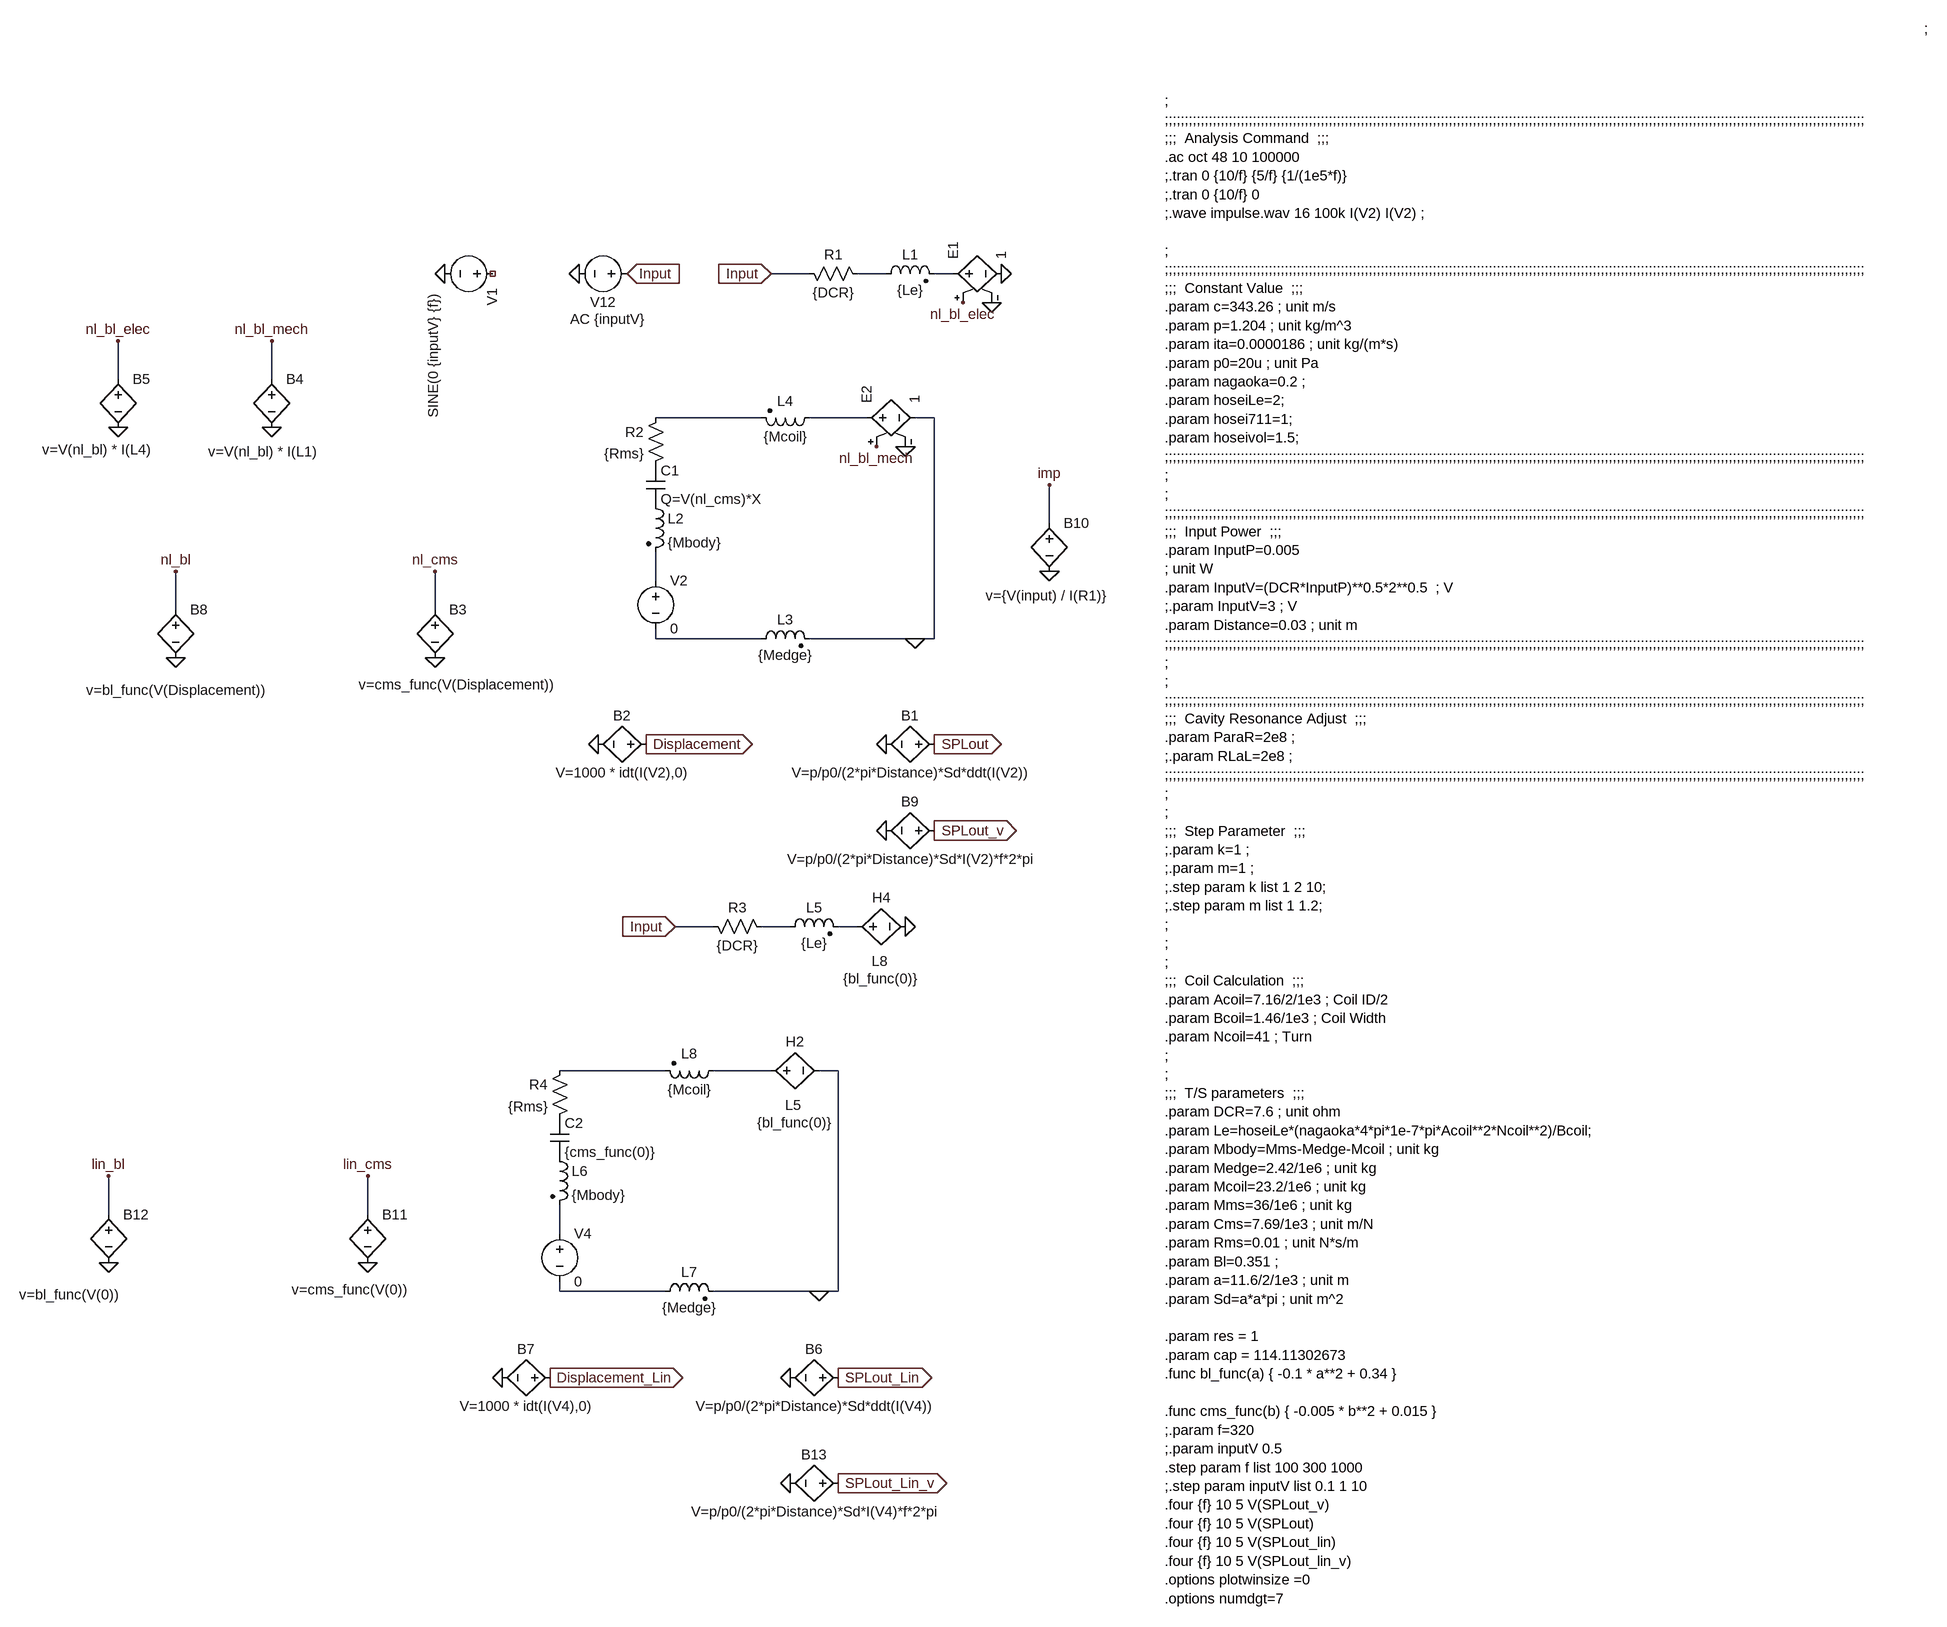
[diagram p0: schematic demo_11_2.asc]
demo_11_2.asc, the LTspice schematic file:
Version 4
SHEET 1 6896 9720
WIRE -2672 -416 -2736 -416
WIRE -2544 -416 -2592 -416
WIRE -2432 -416 -2464 -416
WIRE -3824 -240 -3824 -304
WIRE -3568 -240 -3568 -304
WIRE -2752 -176 -2928 -176
WIRE -2576 -176 -2672 -176
WIRE -2464 -176 -2496 -176
WIRE -2272 0 -2272 -64
WIRE -2928 96 -2928 48
WIRE -3728 144 -3728 80
WIRE -3296 144 -3296 80
WIRE -2928 192 -2928 176
WIRE -2752 192 -2928 192
WIRE -2496 192 -2672 192
WIRE -2464 192 -2464 -176
WIRE -2464 192 -2496 192
WIRE -2832 672 -2896 672
WIRE -2704 672 -2752 672
WIRE -2592 672 -2624 672
WIRE -2912 912 -3088 912
WIRE -2736 912 -2832 912
WIRE -2624 912 -2656 912
WIRE -3840 1152 -3840 1088
WIRE -3408 1152 -3408 1088
WIRE -3088 1184 -3088 1136
WIRE -3088 1280 -3088 1264
WIRE -2912 1280 -3088 1280
WIRE -2656 1280 -2832 1280
WIRE -2624 1280 -2624 912
WIRE -2624 1280 -2656 1280
FLAG -3056 -416 0
FLAG -2976 -416 Input
IOPIN -2976 -416 In
FLAG -2352 -416 0
FLAG -2736 -416 Input
IOPIN -2736 -416 In
FLAG -2496 192 0
FLAG -2464 368 SPLout
IOPIN -2464 368 Out
FLAG -2544 368 0
FLAG -2944 368 Displacement
IOPIN -2944 368 Out
FLAG -3024 368 0
FLAG -3280 -416 0
FLAG -3296 224 0
FLAG -3296 80 nl_cms
FLAG -3568 -160 0
FLAG -3568 -304 nl_bl_mech
FLAG -3824 -160 0
FLAG -3824 -304 nl_bl_elec
FLAG -2416 -368 nl_bl_elec
FLAG -2560 -128 nl_bl_mech
FLAG -2512 -128 0
FLAG -2368 -368 0
FLAG -2512 672 0
FLAG -2896 672 Input
IOPIN -2896 672 In
FLAG -2656 1280 0
FLAG -2624 1424 SPLout_Lin
IOPIN -2624 1424 Out
FLAG -2704 1424 0
FLAG -3104 1424 Displacement_Lin
IOPIN -3104 1424 Out
FLAG -3184 1424 0
FLAG -3728 224 0
FLAG -3728 80 nl_bl
FLAG -2464 512 SPLout_v
IOPIN -2464 512 Out
FLAG -2544 512 0
FLAG -2272 80 0
FLAG -2272 -64 imp
FLAG -3408 1232 0
FLAG -3408 1088 lin_cms
FLAG -3840 1232 0
FLAG -3840 1088 lin_bl
FLAG -2624 1600 SPLout_Lin_v
IOPIN -2624 1600 Out
FLAG -2704 1600 0
SYMBOL voltage -2960 -416 R90
WINDOW 0 32 56 VTop 2
WINDOW 3 -32 56 VBottom 2
WINDOW 123 60 48 VTop 2
SYMATTR InstName V12
SYMATTR Value ""
SYMATTR Value2 AC {inputV}
SYMBOL res -2688 -432 M90
WINDOW 0 0 56 VBottom 2
WINDOW 3 32 56 VTop 2
SYMATTR InstName R1
SYMATTR Value {DCR}
SYMBOL ind2 -2560 -400 R270
WINDOW 0 32 56 VTop 2
WINDOW 3 4 56 VBottom 2
SYMATTR InstName L1
SYMATTR Value {Le}
SYMATTR Type ind
SYMBOL res -2912 -192 M0
SYMATTR InstName R2
SYMATTR Value {Rms}
SYMBOL cap -2944 -96 R0
SYMATTR InstName C1
SYMATTR Value Q=V(nl_cms)*X
SYMBOL h -2752 912 R270
WINDOW 0 32 56 VTop 2
WINDOW 3 -71 55 VBottom 2
WINDOW 38 -42 53 VBottom 2
SYMATTR InstName H2
SYMATTR Value {bl_func(0)}
SYMATTR SpiceModel L5
SYMBOL ind2 -2944 -48 R0
SYMATTR InstName L2
SYMATTR Value {Mbody}
SYMBOL voltage -2928 80 R0
SYMATTR InstName V2
SYMATTR Value 0
SYMBOL ind2 -2768 208 R270
WINDOW 0 32 56 VTop 2
WINDOW 3 4 56 VBottom 2
SYMATTR InstName L3
SYMATTR Value {Medge}
SYMBOL ind2 -2656 -192 R90
WINDOW 0 4 56 VBottom 2
WINDOW 3 32 56 VTop 2
SYMATTR InstName L4
SYMATTR Value {Mcoil}
SYMBOL bv -2448 368 R90
WINDOW 0 -32 56 VBottom 2
WINDOW 3 32 56 VTop 2
SYMATTR InstName B1
SYMATTR Value V=p/p0/(2*pi*Distance)*Sd*ddt(I(V2))
SYMBOL bv -2928 368 R90
WINDOW 0 -32 56 VBottom 2
WINDOW 3 32 56 VTop 2
SYMATTR InstName B2
SYMATTR Value V=1000 * idt(I(V2),0)
SYMBOL h -2608 672 R270
WINDOW 0 32 56 VTop 2
WINDOW 3 -71 55 VBottom 2
WINDOW 38 -42 53 VBottom 2
SYMATTR InstName H4
SYMATTR Value {bl_func(0)}
SYMATTR SpiceModel L8
SYMBOL voltage -3184 -416 R90
WINDOW 3 33 114 Left 2
WINDOW 123 24 38 Left 2
SYMATTR Value SINE(0 {inputV} {f})
SYMATTR InstName V1
SYMBOL bv -3296 128 R0
WINDOW 3 -127 141 Left 2
SYMATTR Value v=cms_func(V(Displacement))
SYMATTR InstName B3
SYMBOL bv -3568 -256 R0
WINDOW 3 -106 137 Left 2
SYMATTR Value v=V(nl_bl) * I(L1)
SYMATTR InstName B4
SYMBOL bv -3824 -256 R0
WINDOW 3 -127 133 Left 2
SYMATTR Value v=V(nl_bl) * I(L4)
SYMATTR InstName B5
SYMBOL e -2448 -416 R270
SYMATTR InstName E1
SYMATTR Value 1
SYMBOL e -2592 -176 R270
SYMATTR InstName E2
SYMATTR Value 1
SYMBOL res -2848 656 M90
WINDOW 0 0 56 VBottom 2
WINDOW 3 32 56 VTop 2
SYMATTR InstName R3
SYMATTR Value {DCR}
SYMBOL ind2 -2720 688 R270
WINDOW 0 32 56 VTop 2
WINDOW 3 4 56 VBottom 2
SYMATTR InstName L5
SYMATTR Value {Le}
SYMATTR Type ind
SYMBOL res -3072 896 M0
SYMATTR InstName R4
SYMATTR Value {Rms}
SYMBOL cap -3104 992 R0
SYMATTR InstName C2
SYMATTR Value {cms_func(0)}
SYMBOL ind2 -3104 1040 R0
SYMATTR InstName L6
SYMATTR Value {Mbody}
SYMBOL voltage -3088 1168 R0
SYMATTR InstName V4
SYMATTR Value 0
SYMBOL ind2 -2928 1296 R270
WINDOW 0 32 56 VTop 2
WINDOW 3 4 56 VBottom 2
SYMATTR InstName L7
SYMATTR Value {Medge}
SYMBOL ind2 -2816 896 R90
WINDOW 0 4 56 VBottom 2
WINDOW 3 32 56 VTop 2
SYMATTR InstName L8
SYMATTR Value {Mcoil}
SYMBOL bv -2608 1424 R90
WINDOW 0 -32 56 VBottom 2
WINDOW 3 32 56 VTop 2
SYMATTR InstName B6
SYMATTR Value V=p/p0/(2*pi*Distance)*Sd*ddt(I(V4))
SYMBOL bv -3088 1424 R90
WINDOW 0 -32 56 VBottom 2
WINDOW 3 32 56 VTop 2
SYMATTR InstName B7
SYMATTR Value V=1000 * idt(I(V4),0)
SYMBOL bv -3728 128 R0
WINDOW 3 -149 150 Left 2
SYMATTR Value v=bl_func(V(Displacement))
SYMATTR InstName B8
SYMBOL bv -2448 512 R90
WINDOW 0 -32 56 VBottom 2
WINDOW 3 32 56 VTop 2
SYMATTR InstName B9
SYMATTR Value V=p/p0/(2*pi*Distance)*Sd*I(V2)*f*2*pi
SYMBOL bv -2272 -16 R0
WINDOW 3 -106 137 Left 2
SYMATTR Value v={V(input) / I(R1)}
SYMATTR InstName B10
SYMBOL bv -3408 1136 R0
WINDOW 3 -127 141 Left 2
SYMATTR Value v=cms_func(V(0))
SYMATTR InstName B11
SYMBOL bv -3840 1136 R0
WINDOW 3 -149 150 Left 2
SYMATTR Value v=bl_func(V(0))
SYMATTR InstName B12
SYMBOL bv -2608 1600 R90
WINDOW 0 -32 56 VBottom 2
WINDOW 3 32 56 VTop 2
SYMATTR InstName B13
SYMATTR Value V=p/p0/(2*pi*Distance)*Sd*I(V4)*f*2*pi
TEXT -2080 -704 Left 2 !;\n;;;;;;;;;;;;;;;;;;;;;;;;;;;;;;;;;;;;;;;;;;;;;;;;;;;;;;;;;;;;;;;;;;;;;;;;;;;;;;;;;;;;;;;;;;;;;;;;;;;;;;;;;;;;;;;;;;;;;;;;;;;;;;;;;;;;;;;;;;;;;;;;;;;;;;;;;;;;;;;;;;;;;;;;;;;;;;;\n;;;  Analysis Command  ;;;\n.ac oct 48 10 100000\n;.tran 0 {10/f} {5/f} {1/(1e5*f)}\n;.tran 0 {10/f} 0\n;.wave impulse.wav 16 100k I(V2) I(V2) ;\n \n;\n;;;;;;;;;;;;;;;;;;;;;;;;;;;;;;;;;;;;;;;;;;;;;;;;;;;;;;;;;;;;;;;;;;;;;;;;;;;;;;;;;;;;;;;;;;;;;;;;;;;;;;;;;;;;;;;;;;;;;;;;;;;;;;;;;;;;;;;;;;;;;;;;;;;;;;;;;;;;;;;;;;;;;;;;;;;;;;;\n;;;  Constant Value  ;;;\n.param c=343.26 ; unit m/s\n.param p=1.204 ; unit kg/m^3\n.param ita=0.0000186 ; unit kg/(m*s)\n.param p0=20u ; unit Pa\n.param nagaoka=0.2 ; \n.param hoseiLe=2;\n.param hosei711=1;\n.param hoseivol=1.5;\n;;;;;;;;;;;;;;;;;;;;;;;;;;;;;;;;;;;;;;;;;;;;;;;;;;;;;;;;;;;;;;;;;;;;;;;;;;;;;;;;;;;;;;;;;;;;;;;;;;;;;;;;;;;;;;;;;;;;;;;;;;;;;;;;;;;;;;;;;;;;;;;;;;;;;;;;;;;;;;;;;;;;;;;;;;;;;;;\n;\n;\n;;;;;;;;;;;;;;;;;;;;;;;;;;;;;;;;;;;;;;;;;;;;;;;;;;;;;;;;;;;;;;;;;;;;;;;;;;;;;;;;;;;;;;;;;;;;;;;;;;;;;;;;;;;;;;;;;;;;;;;;;;;;;;;;;;;;;;;;;;;;;;;;;;;;;;;;;;;;;;;;;;;;;;;;;;;;;;;\n;;;  Input Power  ;;;\n.param InputP=0.005 \n; unit W\n.param InputV=(DCR*InputP)**0.5*2**0.5  ; V\n;.param InputV=3 ; V\n.param Distance=0.03 ; unit m\n;;;;;;;;;;;;;;;;;;;;;;;;;;;;;;;;;;;;;;;;;;;;;;;;;;;;;;;;;;;;;;;;;;;;;;;;;;;;;;;;;;;;;;;;;;;;;;;;;;;;;;;;;;;;;;;;;;;;;;;;;;;;;;;;;;;;;;;;;;;;;;;;;;;;;;;;;;;;;;;;;;;;;;;;;;;;;;;\n;\n;\n;;;;;;;;;;;;;;;;;;;;;;;;;;;;;;;;;;;;;;;;;;;;;;;;;;;;;;;;;;;;;;;;;;;;;;;;;;;;;;;;;;;;;;;;;;;;;;;;;;;;;;;;;;;;;;;;;;;;;;;;;;;;;;;;;;;;;;;;;;;;;;;;;;;;;;;;;;;;;;;;;;;;;;;;;;;;;;;\n;;;  Cavity Resonance Adjust  ;;;\n.param ParaR=2e8 ;\n;.param RLaL=2e8 ;\n;;;;;;;;;;;;;;;;;;;;;;;;;;;;;;;;;;;;;;;;;;;;;;;;;;;;;;;;;;;;;;;;;;;;;;;;;;;;;;;;;;;;;;;;;;;;;;;;;;;;;;;;;;;;;;;;;;;;;;;;;;;;;;;;;;;;;;;;;;;;;;;;;;;;;;;;;;;;;;;;;;;;;;;;;;;;;;;\n;\n;\n;;;  Step Parameter  ;;;\n;.param k=1 ;\n;.param m=1 ;\n;.step param k list 1 2 10;\n;.step param m list 1 1.2;\n;\n;\n;\n;;;  Coil Calculation  ;;;\n.param Acoil=7.16/2/1e3 ; Coil ID/2\n.param Bcoil=1.46/1e3 ; Coil Width\n.param Ncoil=41 ; Turn\n;\n;\n;;;  T/S parameters  ;;;\n.param DCR=7.6 ; unit ohm\n.param Le=hoseiLe*(nagaoka*4*pi*1e-7*pi*Acoil**2*Ncoil**2)/Bcoil; \n.param Mbody=Mms-Medge-Mcoil ; unit kg\n.param Medge=2.42/1e6 ; unit kg\n.param Mcoil=23.2/1e6 ; unit kg\n.param Mms=36/1e6 ; unit kg\n.param Cms=7.69/1e3 ; unit m/N\n.param Rms=0.01 ; unit N*s/m\n.param Bl=0.351 ;\n.param a=11.6/2/1e3 ; unit m\n.param Sd=a*a*pi ; unit m^2\n \n.param res = 1\n.param cap = 114.11302673\n.func bl_func(a) { -0.1 * a**2 + 0.34 }\n \n.func cms_func(b) { -0.005 * b**2 + 0.015 }\n;.param f=320\n;.param inputV 0.5\n.step param f list 100 300 1000\n;.step param inputV list 0.1 1 10\n.four {f} 10 5 V(SPLout_v)\n.four {f} 10 5 V(SPLout)\n.four {f} 10 5 V(SPLout_lin)\n.four {f} 10 5 V(SPLout_lin_v) \n.options plotwinsize =0\n.options numdgt=7
TEXT 2064 -1288 Left 2 !;

The netlist it stands for:
* demo_11_2.asc
V12 Input 0 AC {inputV}
R1 Input N001 {DCR}
L1 N001 N002 {Le}
R2 N003 P001 {Rms}
C1 P001 P002 Q=V(nl_cms)*X
H2 N010 0 L5 {bl_func(0)}
L2 P002 N005 {Mbody}
V2 N005 N006 0
L3 N006 0 {Medge}
L4 N004 N003 {Mcoil}
B1 SPLout 0 V=p/p0/(2*pi*Distance)*Sd*ddt(I(V2))
B2 Displacement 0 V=1000 * idt(I(V2),0)
H4 N008 0 L8 {bl_func(0)}
V1 NC_01 0 SINE(0 {inputV} {f})
B3 nl_cms 0 v=cms_func(V(Displacement))
B4 nl_bl_mech 0 v=V(nl_bl) * I(L1)
B5 nl_bl_elec 0 v=V(nl_bl) * I(L4)
E1 N002 0 nl_bl_elec 0 1
E2 N004 0 nl_bl_mech 0 1
R3 Input N007 {DCR}
L5 N007 N008 {Le}
R4 N009 P003 {Rms}
C2 P003 P004 {cms_func(0)}
L6 P004 N011 {Mbody}
V4 N011 N012 0
L7 N012 0 {Medge}
L8 N010 N009 {Mcoil}
B6 SPLout_Lin 0 V=p/p0/(2*pi*Distance)*Sd*ddt(I(V4))
B7 Displacement_Lin 0 V=1000 * idt(I(V4),0)
B8 nl_bl 0 v=bl_func(V(Displacement))
B9 SPLout_v 0 V=p/p0/(2*pi*Distance)*Sd*I(V2)*f*2*pi
B10 imp 0 v={V(input) / I(R1)}
B11 lin_cms 0 v=cms_func(V(0))
B12 lin_bl 0 v=bl_func(V(0))
B13 SPLout_Lin_v 0 V=p/p0/(2*pi*Distance)*Sd*I(V4)*f*2*pi
;
;;;;;;;;;;;;;;;;;;;;;;;;;;;;;;;;;;;;;;;;;;;;;;;;;;;;;;;;;;;;;;;;;;;;;;;;;;;;;;;;;;;;;;;;;;;;;;;;;;;;;;;;;;;;;;;;;;;;;;;;;;;;;;;;;;;;;;;;;;;;;;;;;;;;;;;;;;;;;;;;;;;;;;;;;;;;;;;
;;;  Analysis Command  ;;;
.ac oct 48 10 100000
;.tran 0 {10/f} {5/f} {1/(1e5*f)}
;.tran 0 {10/f} 0
;.wave impulse.wav 16 100k I(V2) I(V2) ;
;
;;;;;;;;;;;;;;;;;;;;;;;;;;;;;;;;;;;;;;;;;;;;;;;;;;;;;;;;;;;;;;;;;;;;;;;;;;;;;;;;;;;;;;;;;;;;;;;;;;;;;;;;;;;;;;;;;;;;;;;;;;;;;;;;;;;;;;;;;;;;;;;;;;;;;;;;;;;;;;;;;;;;;;;;;;;;;;;
;;;  Constant Value  ;;;
.param c=343.26 ; unit m/s
.param p=1.204 ; unit kg/m^3
.param ita=0.0000186 ; unit kg/(m*s)
.param p0=20u ; unit Pa
.param nagaoka=0.2 ;
.param hoseiLe=2;
.param hosei711=1;
.param hoseivol=1.5;
;;;;;;;;;;;;;;;;;;;;;;;;;;;;;;;;;;;;;;;;;;;;;;;;;;;;;;;;;;;;;;;;;;;;;;;;;;;;;;;;;;;;;;;;;;;;;;;;;;;;;;;;;;;;;;;;;;;;;;;;;;;;;;;;;;;;;;;;;;;;;;;;;;;;;;;;;;;;;;;;;;;;;;;;;;;;;;;
;
;
;;;;;;;;;;;;;;;;;;;;;;;;;;;;;;;;;;;;;;;;;;;;;;;;;;;;;;;;;;;;;;;;;;;;;;;;;;;;;;;;;;;;;;;;;;;;;;;;;;;;;;;;;;;;;;;;;;;;;;;;;;;;;;;;;;;;;;;;;;;;;;;;;;;;;;;;;;;;;;;;;;;;;;;;;;;;;;;
;;;  Input Power  ;;;
.param InputP=0.005
; unit W
.param InputV=(DCR*InputP)**0.5*2**0.5  ; V
;.param InputV=3 ; V
.param Distance=0.03 ; unit m
;;;;;;;;;;;;;;;;;;;;;;;;;;;;;;;;;;;;;;;;;;;;;;;;;;;;;;;;;;;;;;;;;;;;;;;;;;;;;;;;;;;;;;;;;;;;;;;;;;;;;;;;;;;;;;;;;;;;;;;;;;;;;;;;;;;;;;;;;;;;;;;;;;;;;;;;;;;;;;;;;;;;;;;;;;;;;;;
;
;
;;;;;;;;;;;;;;;;;;;;;;;;;;;;;;;;;;;;;;;;;;;;;;;;;;;;;;;;;;;;;;;;;;;;;;;;;;;;;;;;;;;;;;;;;;;;;;;;;;;;;;;;;;;;;;;;;;;;;;;;;;;;;;;;;;;;;;;;;;;;;;;;;;;;;;;;;;;;;;;;;;;;;;;;;;;;;;;
;;;  Cavity Resonance Adjust  ;;;
.param ParaR=2e8 ;
;.param RLaL=2e8 ;
;;;;;;;;;;;;;;;;;;;;;;;;;;;;;;;;;;;;;;;;;;;;;;;;;;;;;;;;;;;;;;;;;;;;;;;;;;;;;;;;;;;;;;;;;;;;;;;;;;;;;;;;;;;;;;;;;;;;;;;;;;;;;;;;;;;;;;;;;;;;;;;;;;;;;;;;;;;;;;;;;;;;;;;;;;;;;;;
;
;
;;;  Step Parameter  ;;;
;.param k=1 ;
;.param m=1 ;
;.step param k list 1 2 10;
;.step param m list 1 1.2;
;
;
;
;;;  Coil Calculation  ;;;
.param Acoil=7.16/2/1e3 ; Coil ID/2
.param Bcoil=1.46/1e3 ; Coil Width
.param Ncoil=41 ; Turn
;
;
;;;  T/S parameters  ;;;
.param DCR=7.6 ; unit ohm
.param Le=hoseiLe*(nagaoka*4*pi*1e-7*pi*Acoil**2*Ncoil**2)/Bcoil;
.param Mbody=Mms-Medge-Mcoil ; unit kg
.param Medge=2.42/1e6 ; unit kg
.param Mcoil=23.2/1e6 ; unit kg
.param Mms=36/1e6 ; unit kg
.param Cms=7.69/1e3 ; unit m/N
.param Rms=0.01 ; unit N*s/m
.param Bl=0.351 ;
.param a=11.6/2/1e3 ; unit m
.param Sd=a*a*pi ; unit m^2
.param res = 1
.param cap = 114.11302673
.func bl_func(a) { -0.1 * a**2 + 0.34 }
.func cms_func(b) { -0.005 * b**2 + 0.015 }
;.param f=320
;.param inputV 0.5
.step param f list 100 300 1000
;.step param inputV list 0.1 1 10
.four {f} 10 5 V(SPLout_v)
.four {f} 10 5 V(SPLout)
.four {f} 10 5 V(SPLout_lin)
.four {f} 10 5 V(SPLout_lin_v)
.options plotwinsize =0
.options numdgt=7
;
.backanno
.end

* Results of the author's LTspice run, read from the files saved beside the schematic
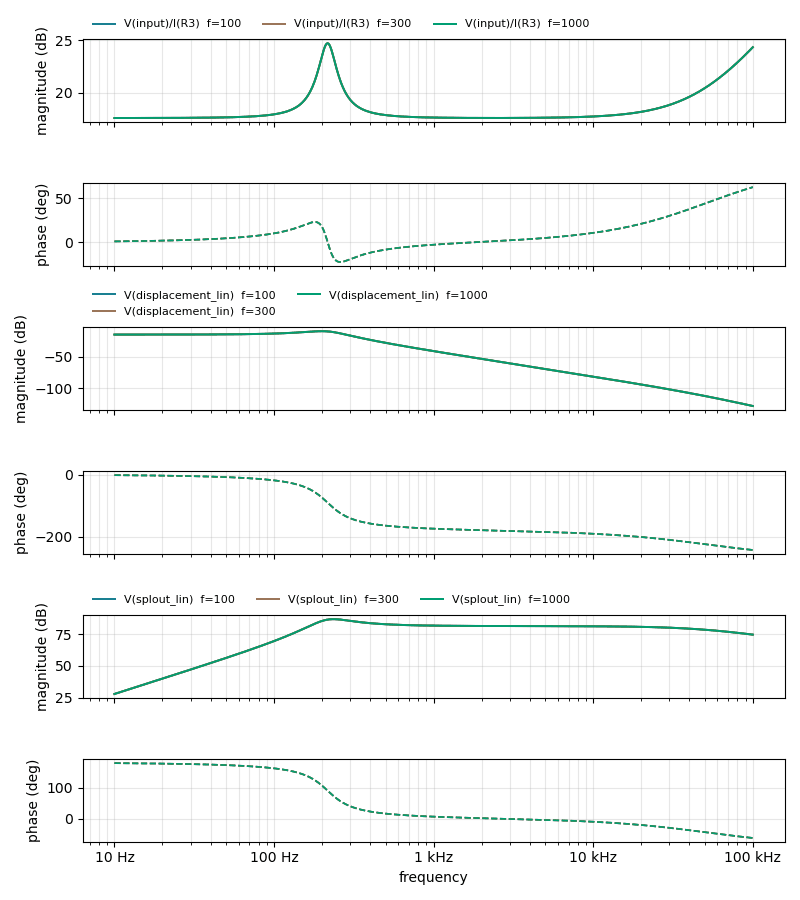
[diagram p1: AC Analysis of demo_11_2.asc, plotted from the saved traces]
* AC Analysis, 3 runs:
*   V(input)/I(R3) [f=100]: 17.62 dB at 10 Hz, 24.35 dB at 100 kHz, peak 24.73 dB at 216.7 Hz, 3 dB below the peak at 185.2 Hz and 253.1 Hz
*   V(input)/I(R3) [f=300]: 17.62 dB at 10 Hz, 24.35 dB at 100 kHz, peak 24.73 dB at 216.7 Hz, 3 dB below the peak at 185.2 Hz and 253.1 Hz
*   V(input)/I(R3) [f=1000]: 17.62 dB at 10 Hz, 24.35 dB at 100 kHz, peak 24.73 dB at 216.7 Hz, 3 dB below the peak at 185.2 Hz and 253.1 Hz
*   V(displacement_lin) [f=100]: -14.64 dB at 10 Hz, -127.96 dB at 100 kHz, peak -9.21 dB at 198.7 Hz, 3 dB below the peak at 121 Hz and 254.5 Hz
*   V(displacement_lin) [f=300]: -14.64 dB at 10 Hz, -127.96 dB at 100 kHz, peak -9.21 dB at 198.7 Hz, 3 dB below the peak at 121 Hz and 254.5 Hz
*   V(displacement_lin) [f=1000]: -14.64 dB at 10 Hz, -127.96 dB at 100 kHz, peak -9.21 dB at 198.7 Hz, 3 dB below the peak at 121 Hz and 254.5 Hz
*   V(splout_lin) [f=100]: 27.85 dB at 10 Hz, 74.53 dB at 100 kHz, peak 86.72 dB at 236.3 Hz, 3 dB below the peak at 184.5 Hz and 388.2 Hz
*   V(splout_lin) [f=300]: 27.85 dB at 10 Hz, 74.53 dB at 100 kHz, peak 86.72 dB at 236.3 Hz, 3 dB below the peak at 184.5 Hz and 388.2 Hz
*   V(splout_lin) [f=1000]: 27.85 dB at 10 Hz, 74.53 dB at 100 kHz, peak 86.72 dB at 236.3 Hz, 3 dB below the peak at 184.5 Hz and 388.2 Hz